# Altium schematic sheet MPPT.SchDoc: MPPT
size A4; DrawnBy: Burak Kurtulmuş; Revision: 1; Time: hh
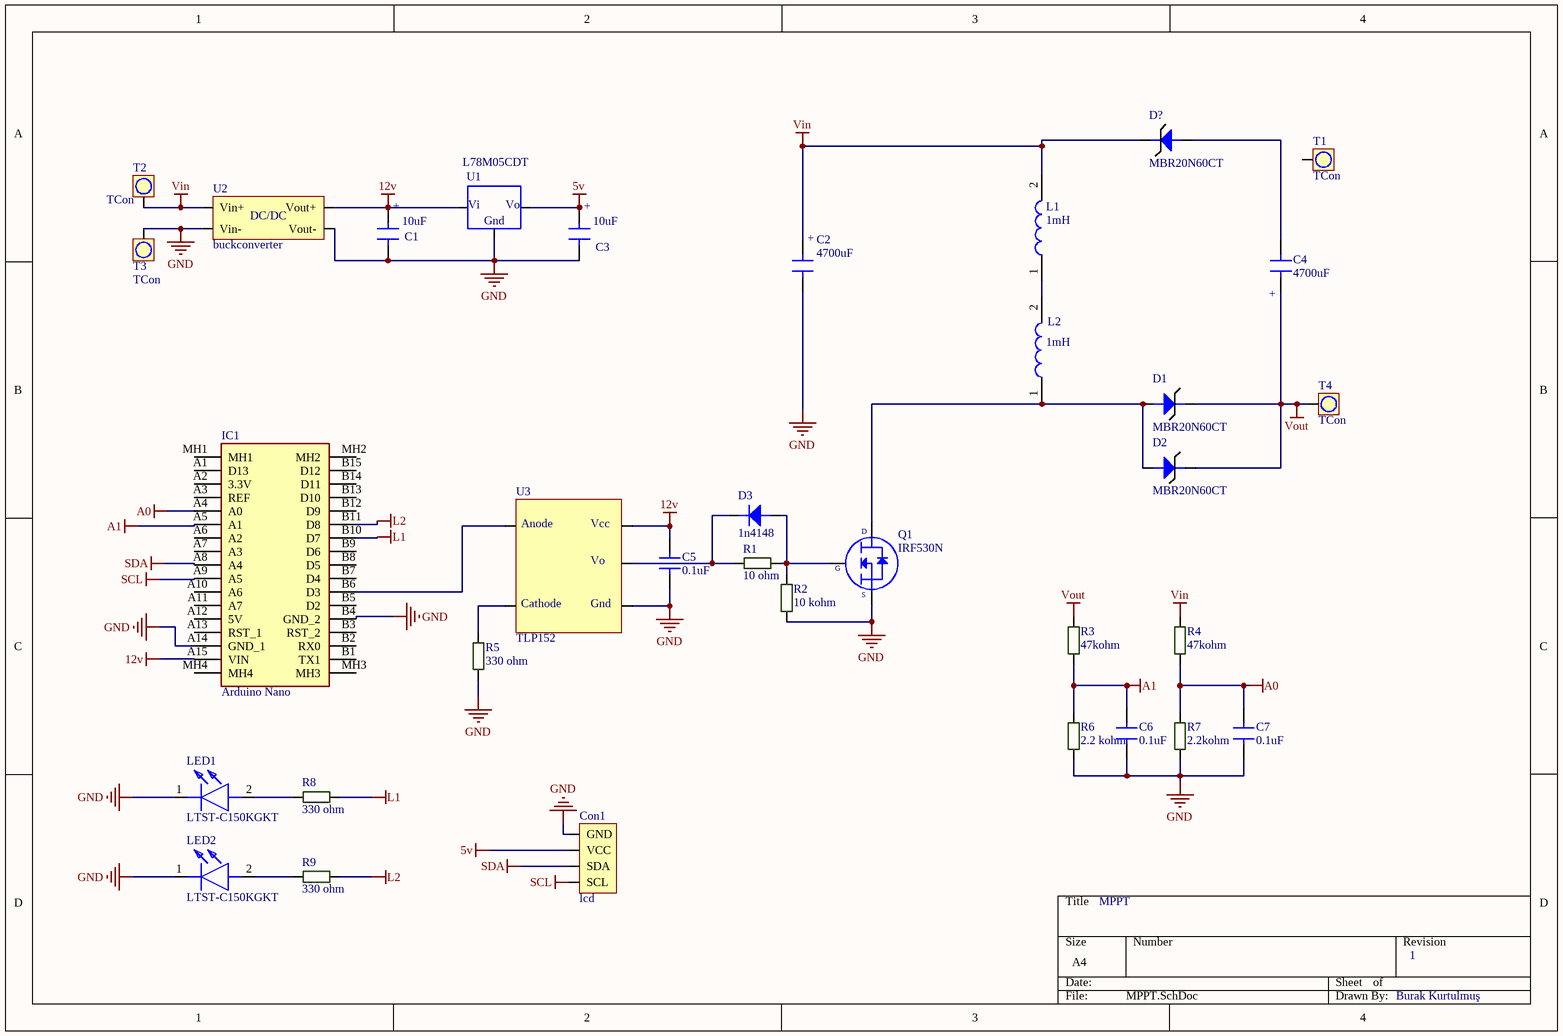
[diagram p0: MPPT.SchDoc]

## Parts
C1  10uF  [CapSmdElc]
C2  4700uF  [Koshin 63v 4700 cap]
C3  10uF  [CapSmdElc]
C4  4700uF  [Koshin 63v 4700 cap]
C5  0.1uF  [C-1206W]
C6  0.1uF  [C-1206W]
C7  0.1uF  [C-1206W]
Con1  lcd  [lcd]
D1  MBR20N60CT  [TO254P483X1016X1994-3P]
D2  MBR20N60CT  [TO254P483X1016X1994-3P]
D3  1n4148  [SOD123]
D?  MBR20N60CT  [TO254P483X1016X1994-3P]
IC1  Arduino Nano  [ABX00028]
L1  1mH  [L]
L2  1mH  [L]
LED1  LTST-C150KGKT  [L-1206]
LED2  LTST-C150KGKT  [L-1206]
Q1  IRF530N  [DPAK_TO263]
R1  10 ohm  [R-1206W]
R2  10 kohm  [R-1206W]
R3  47kohm  [R-1206W]
R4  47kohm  [R-1206W]
R5  330 ohm  [R-1206W]
R6  2.2 kohm  [R-1206W]
R7  2.2kohm  [R-1206W]
R8  330 ohm  [R-1206W]
R9  330 ohm  [R-1206W]
T1  TCon  [2pinCon]
T2  TCon  [2pinCon]
T3  TCon  [2pinCon]
T4  TCon  [2pinCon]
U1  L78M05CDT  [TO-252]
U2  buckconverter  [DC_BOOST]
U3  TLP152  [TLP152]

## Nets
5v: C3.1 Con1.2(VCC) U1.3
12v: C1.1 C5.2 IC1.A15(VIN) U1.1 U2.4(Vout+) U3.5
A0: C7.2 IC1.A4(A0) R4.1 R7.2
A1: C6.2 IC1.A5(A1) R3.2 R6.2
GND: C1.2 C2.1 C3.2 C5.1 C6.1 C7.1 Con1.1(GND) IC1.A14(GND_1) IC1.B4(GND_2) LED1.1(K) LED2.1(K) Q1.2 R2.1 R5.1 R6.1 R7.1 T3.1 U1.4 U2.2(Vin-) U2.3(Vout-) U3.3
L1: IC1.B10(D7) R8.2
L2: IC1.B11(D8) R9.2
SCL: Con1.4(SCL) IC1.A9(A5)
SDA: Con1.3(SDA) IC1.A8(A4)
Vin: C2.2 D?.1 L1.2 R4.2 T2.1 U2.1(Vin+)
Vout: C4.2 D1.1 D2.1 R3.1 T4.1
NetC4_1: C4.1 D?.2
NetD1_2: D1.2 D2.2 L2.1 Q1.3
NetD3_a: D3.a Q1.1 R1.2 R2.2
NetD3_k: D3.k R1.1 U3.4
NetIC1_B6: IC1.B6(D3) U3.1
NetL1_1: L1.1 L2.2
NetLED1_2: LED1.2(A) R8.1
NetLED2_2: LED2.2(A) R9.1
NetR5_2: R5.2 U3.2

Not connected (* = marked no-connect by the designer): IC1 A1(D13) A2(3.3V) A3(REF) A6(A2) A7(A3) A10(A6) A11(A7) A12(5V) A13(RST_1) B1(TX1) B2(RX0) B3(RST_2) B5(D2) B7(D4) B8(D5) B9(D6) B12(D9) B13(D10) B14(D11) B15(D12) MH1 MH2 MH3 MH4; T1 1

## Notes on the sheet
- Title
- Size:
- Date:
- A4
- Number:
- Time:
- Revision:
- Sheet
- of
- File:
- (in symbol 4700) +
- (in symbol buck) DC/DC
- (in symbol C-10uf) +
- (in symbol IRF3205STRLPBF) D; G; S
- (in symbol L78M15CDT) Vi; Vo; Gnd
- (in symbol TLP152(TPL,E) Anode; Vcc; Vo; Cathode; Gnd

## Library data of the parts
C1 C3 = C-10uf
C2 C4 = 4700
C5-C7 = C-1206
D1 D2 D? = schotky: Diode Small Signal Switching 100V 0.15A 2-Pin SOD-123 T/R; Manufacturer: Vishay; Manufacturer Part Number: 1N4148W-E3-18; Recovery Time: 4ns; Max Power Dissipation: 350mW; Forward Current: 150mA; Max Surge Current: 2A; Forward Voltage: 1.2V; Max Reverse Leakage Current: 5uA; Element Configuration: Single; Max Reverse Voltage (DC): 75V; Peak Reverse Current: 100uA; Supplier 1: Allied Electronics; RoHS: Yes; Stock 1: 6838; Pricing 1: 1 = 0.03900, 25 = 0.03800, 100 = 0.03600, 250 = 0.03400, 500 = 0.03200, 1000 = 0.03100, 2500 = 0.02900 (USD); Mount: Surface Mount; Number of Pins: 2; Weight: 0.000363oz; Contact Plating: Tin; Min Operating Temperature: -55°C; Max Operating Temperature: 150°C; Packaging: Tape and Reel; Package Quantity: 10000; Average Rectified Current: 150mA; Reverse Recovery Time: 4ns; Power Dissipation: 350mW; Max Repetitive Reverse Voltage (Vrrm): 100V; Peak Non-Repetitive Surge Current: 2A; Length: 2.85mm; Height: 1.25mm; Width: 1.7mm; Radiation Hardening: No; Lead Free: Lead Free; ComponentLink1URL: https://datasheet.ciiva.com/29885/1n4148w-29885941.pdf?src-supplier=Avnet; ComponentLink1Description: https://datasheet.ciiva.com/29885/1n4148w-29885941.pdf?src-supplier=Avnet; ComponentLink2URL: https://datasheet.ciiva.com/29593/1n4148w-29593113.pdf?src-supplier=Digi-Key; ComponentLink2Description: https://datasheet.ciiva.com/29593/1n4148w-29593113.pdf?src-supplier=Digi-Key; ComponentLink3URL: https://datasheet.ciiva.com/29593/1n4148w-29593111.pdf?src-supplier=Digi-Key; ComponentLink3Description: https://datasheet.ciiva.com/29593/1n4148w-29593111.pdf?src-supplier=Digi-Key; ComponentLink4URL: https://datasheet.ciiva.com/29593/1n4148w-29593112.pdf?src-supplier=Digi-Key; ComponentLink4Description: https://datasheet.ciiva.com/29593/1n4148w-29593112.pdf?src-supplier=Digi-Key; Supplier Part Number 1: 70061597
D3 = 1N5819w: Diode Small Signal Switching 100V 0.15A 2-Pin SOD-123 T/R; Manufacturer: Vishay; Manufacturer Part Number: 1N4148W-E3-18; Recovery Time: 4ns; Max Power Dissipation: 350mW; Forward Current: 150mA; Max Surge Current: 2A; Forward Voltage: 1.2V; Max Reverse Leakage Current: 5uA; Element Configuration: Single; Max Reverse Voltage (DC): 75V; Peak Reverse Current: 100uA; Supplier 1: Allied Electronics; RoHS: Yes; Stock 1: 6838; Pricing 1: 1 = 0.03900, 25 = 0.03800, 100 = 0.03600, 250 = 0.03400, 500 = 0.03200, 1000 = 0.03100, 2500 = 0.02900 (USD); Mount: Surface Mount; Number of Pins: 2; Weight: 0.000363oz; Contact Plating: Tin; Min Operating Temperature: -55°C; Max Operating Temperature: 150°C; Packaging: Tape and Reel; Package Quantity: 10000; Average Rectified Current: 150mA; Reverse Recovery Time: 4ns; Power Dissipation: 350mW; Max Repetitive Reverse Voltage (Vrrm): 100V; Peak Non-Repetitive Surge Current: 2A; Length: 2.85mm; Height: 1.25mm; Width: 1.7mm; Radiation Hardening: No; Lead Free: Lead Free; ComponentLink1URL: https://datasheet.ciiva.com/29885/1n4148w-29885941.pdf?src-supplier=Avnet; ComponentLink1Description: https://datasheet.ciiva.com/29885/1n4148w-29885941.pdf?src-supplier=Avnet; ComponentLink2URL: https://datasheet.ciiva.com/29593/1n4148w-29593113.pdf?src-supplier=Digi-Key; ComponentLink2Description: https://datasheet.ciiva.com/29593/1n4148w-29593113.pdf?src-supplier=Digi-Key; ComponentLink3URL: https://datasheet.ciiva.com/29593/1n4148w-29593111.pdf?src-supplier=Digi-Key; ComponentLink3Description: https://datasheet.ciiva.com/29593/1n4148w-29593111.pdf?src-supplier=Digi-Key; ComponentLink4URL: https://datasheet.ciiva.com/29593/1n4148w-29593112.pdf?src-supplier=Digi-Key; ComponentLink4Description: https://datasheet.ciiva.com/29593/1n4148w-29593112.pdf?src-supplier=Digi-Key; Supplier Part Number 1: 70061597
IC1 = ABX00028: Integrated Circuit; Datasheet Link: https://store.arduino.cc/arduino-nano-every; Height: 10mm; Manufacturer_Name: Arduino; Manufacturer_Part_Number: ABX00028; Mouser Part Number: 782-ABX00028; Mouser Price/Stock: https://www.mouser.co.uk/ProductDetail/Arduino/ABX00028?qs=PzGy0jfpSMtit6rnFl8mVg%3D%3D; RS Part Number: 1927586; RS Price/Stock: http://uk.rs-online.com/web/p/products/1927586
L1 L2 = L: Inductor; Manufacturer_Name: ABRACON; Manufacturer_Part_Number: ATFC-0201-10N-G-T; Datasheet Link: http://www.abracon.com/Magnetics/new/ATFC-0201.pdf; Height: 0.28mm; Mouser Part Number: 815-ATFC-0201-10NG; Mouser Price/Stock: https://www.mouser.com/Search/Refine.aspx?Keyword=815-ATFC-0201-10NG
LED1 LED2 = LTST-C150KGKT: LED; Manufacturer_Name: Lite-On; Datasheet Link: http://optoelectronics.liteon.com/upload/download/ds22-2000-072/ltst-c150kgkt.pdf; Height: 1.2mm; Manufacturer_Part_Number: LTST-C150KGKT; Mouser Part Number: 859-LTST-C150KGKT; Mouser Price/Stock: https://www.mouser.com/Search/Refine.aspx?Keyword=859-LTST-C150KGKT; RS Part Number: 6920871; RS Price/Stock: https://uk.rs-online.com/web/p/products/6920871
Q1 = IRF3205STRLPBF: MOSFET N-CH 55V 110A D2PAK; Manufacturer: Infineon; Rds On Max: 8mR; Input Capacitance: 3.247nF; Max Power Dissipation: 200W; Turn-Off Delay Time: 50ns; Turn-On Delay Time: 14ns; Gate to Source Voltage (Vgs): 20V; Threshold Voltage: 4V; Supplier 1: Digi-Key; Manufacturer Part Number: IRF3205STRLPBF; RoHS: Yes; Stock 1: 3281; Pricing 1: 1 = 1,84000, 10 = 1,66600, 100 = 1,33840 (USD); Mount: Surface Mount; Case/Package: D2PAK; Number of Pins: 3; Min Operating Temperature: -55°C; Max Operating Temperature: 175°C; Packaging: Cut Tape; Drain to Source Voltage (Vdss): 55V; Continuous Drain Current (ID): 110A; Power Dissipation: 200W; Drain to Source Resistance: 8mR; Drain to Source Breakdown Voltage: 55V; Length: 0.42inch; Height: 0.19inch; Width: 0.38inch; REACH SVHC: No SVHC; Lead Free: Lead Free; ComponentLink1URL: https://www.alliedelec.com/m/d/b8827ca43655240244f0cc5c2198e6b1.pdf?src-supplier=Allied+Electronics; ComponentLink1Description: https://www.alliedelec.com/m/d/b8827ca43655240244f0cc5c2198e6b1.pdf?src-supplier=Allied+Electronics; ComponentLink2URL: https://www.infineon.com/dgdl/irf3205spbf.pdf?fileId=5546d462533600a4015355defac9190c&src-supplier=Digi-Key; ComponentLink2Description: https://www.infineon.com/dgdl/irf3205spbf.pdf?fileId=5546d462533600a4015355defac9190c&src-supplier=Digi-Key; ComponentLink3URL: http://www.infineon.com/dgdl/irf3205spbf.pdf?fileId=5546d462533600a4015355defac9190c&src-supplier=Digi-Key; ComponentLink3Description: http://www.infineon.com/dgdl/irf3205spbf.pdf?fileId=5546d462533600a4015355defac9190c&src-supplier=Digi-Key; ComponentLink4URL: http://www.farnell.com/datasheets/1884183.pdf?src-supplier=Element14; ComponentLink4Description: http://www.farnell.com/datasheets/1884183.pdf?src-supplier=Element14; Supplier Part Number 1: IRF3205STRLPBFCT-ND
R1-R9 = R-1206: Res1206
T1-T4 = Terminal Connector: ComponentLink1Description: https://www.ozdisan.com/konnektor-baglanti-elemanlari/terminal-konnektorler/vida-tipi-konnektorler/K36-00AH; ComponentLink1URL: https://www.ozdisan.com/konnektor-baglanti-elemanlari/terminal-konnektorler/vida-tipi-konnektorler/K36-00AH
U1 = L78M15CDT: Linear Voltage Regulators 15V 0.5A Positive; Manufacturer: STMicroelectronics; Max Output Current: 500mA; Number of Outputs: 1; Max Input Voltage: 35V; Quiescent Current: 6mA; Output Type: Fixed; Dropout Voltage: 2V; Supplier 1: Avnet; Manufacturer Part Number: L78M15CDT; RoHS: Yes; Mount: Surface Mount; Case/Package: DPAK; Number of Pins: 3; Min Operating Temperature: 0°C; Max Operating Temperature: 150°C; Output Voltage: 15V; Polarity: Positive; Packaging: Rail/Tube; Output Current: 500mA; Min Input Voltage: 35V; Package Quantity: 75; Length: 6.6mm; Height: 2.4mm; Width: 6.2mm; Radiation Hardening: No; ComponentLink1URL: http://docs-usa.electrocomponents.com/techlib:/itc_doclist_US.htm?stockno=1890999&src-supplier=Allied+Electronics; ComponentLink1Description: http://docs-usa.electrocomponents.com/techlib:/itc_doclist_US.htm?stockno=1890999&src-supplier=Allied+Electronics; ComponentLink2URL: http://www.st.com/web/en/resource/technical/document/datasheet/CD00000447.pdf?src-supplier=Avnet+Europe; ComponentLink2Description: http://www.st.com/web/en/resource/technical/document/datasheet/CD00000447.pdf?src-supplier=Avnet+Europe; ComponentLink3URL: http://www.mouser.com/ds/2/389/stmicroelectronics_cd00000447-329548.pdf?src-supplier=Mouser; ComponentLink3Description: http://www.mouser.com/ds/2/389/stmicroelectronics_cd00000447-329548.pdf?src-supplier=Mouser; Supplier Part Number 1: L78M15CDT
U2 = buck
U3 = TLP152(TPL,E: OPTOISO 3.75KV GATE DRIVER 6SO-5; Manufacturer: Toshiba; Number of Channels: 1; Propagation Delay: 165ns; Max Power Dissipation: 260mW; Direction: Unidirectional; Turn-On Delay Time: 190ns; Fall Time: 22ns; Forward Voltage: 1.57V; Output Current: 2.5A; Forward Current: 10mA; Rise Time: 18ns; High Level Output Current: 2A; Pulse Width Distortion (PWD): 50ns; Supplier 1: Mouser; Manufacturer Part Number: TLP152(TPL,E; RoHS: Yes; Stock 1: 22321; Pricing 1: 1 = 1.55000, 10 = 0.96800, 50 = 0.96800, 100 = 0.87200, 1000 = 0.54300, 10000 = 0.44000 (USD); Mount: Surface Mount; Case/Package: SO; Number of Pins: 5; Min Operating Temperature: -40°C; Max Operating Temperature: 100°C; Packaging: Tape and Reel; Package Quantity: 3000; Low Level Output Current: 2A; Max Output Current: 2.5A; ComponentLink1URL: https://datasheet.ciiva.com/41848/tlp152-datasheet-en-20120914-41848928.pdf?src-supplier=Digi-Key; ComponentLink1Description: https://datasheet.ciiva.com/41848/tlp152-datasheet-en-20120914-41848928.pdf?src-supplier=Digi-Key; Supplier Part Number 1: 757-TLP152TPLE